# EAGLE design MTAP-Embedded (EAGLE 9.6.2)
ABTEILUNG: Technische Informatik; BEARBEITER: Simon Grundner; DATUM: 2022/10/05; DOKUMENTART: Schaltplan; GEZ: GruS; ID: 4AHEL; REV: 1; SCHALTPLAN: MTAP-MIDI-GC; STATUS: Prototyp; VER: 1.0

## Sheet 1 of 3
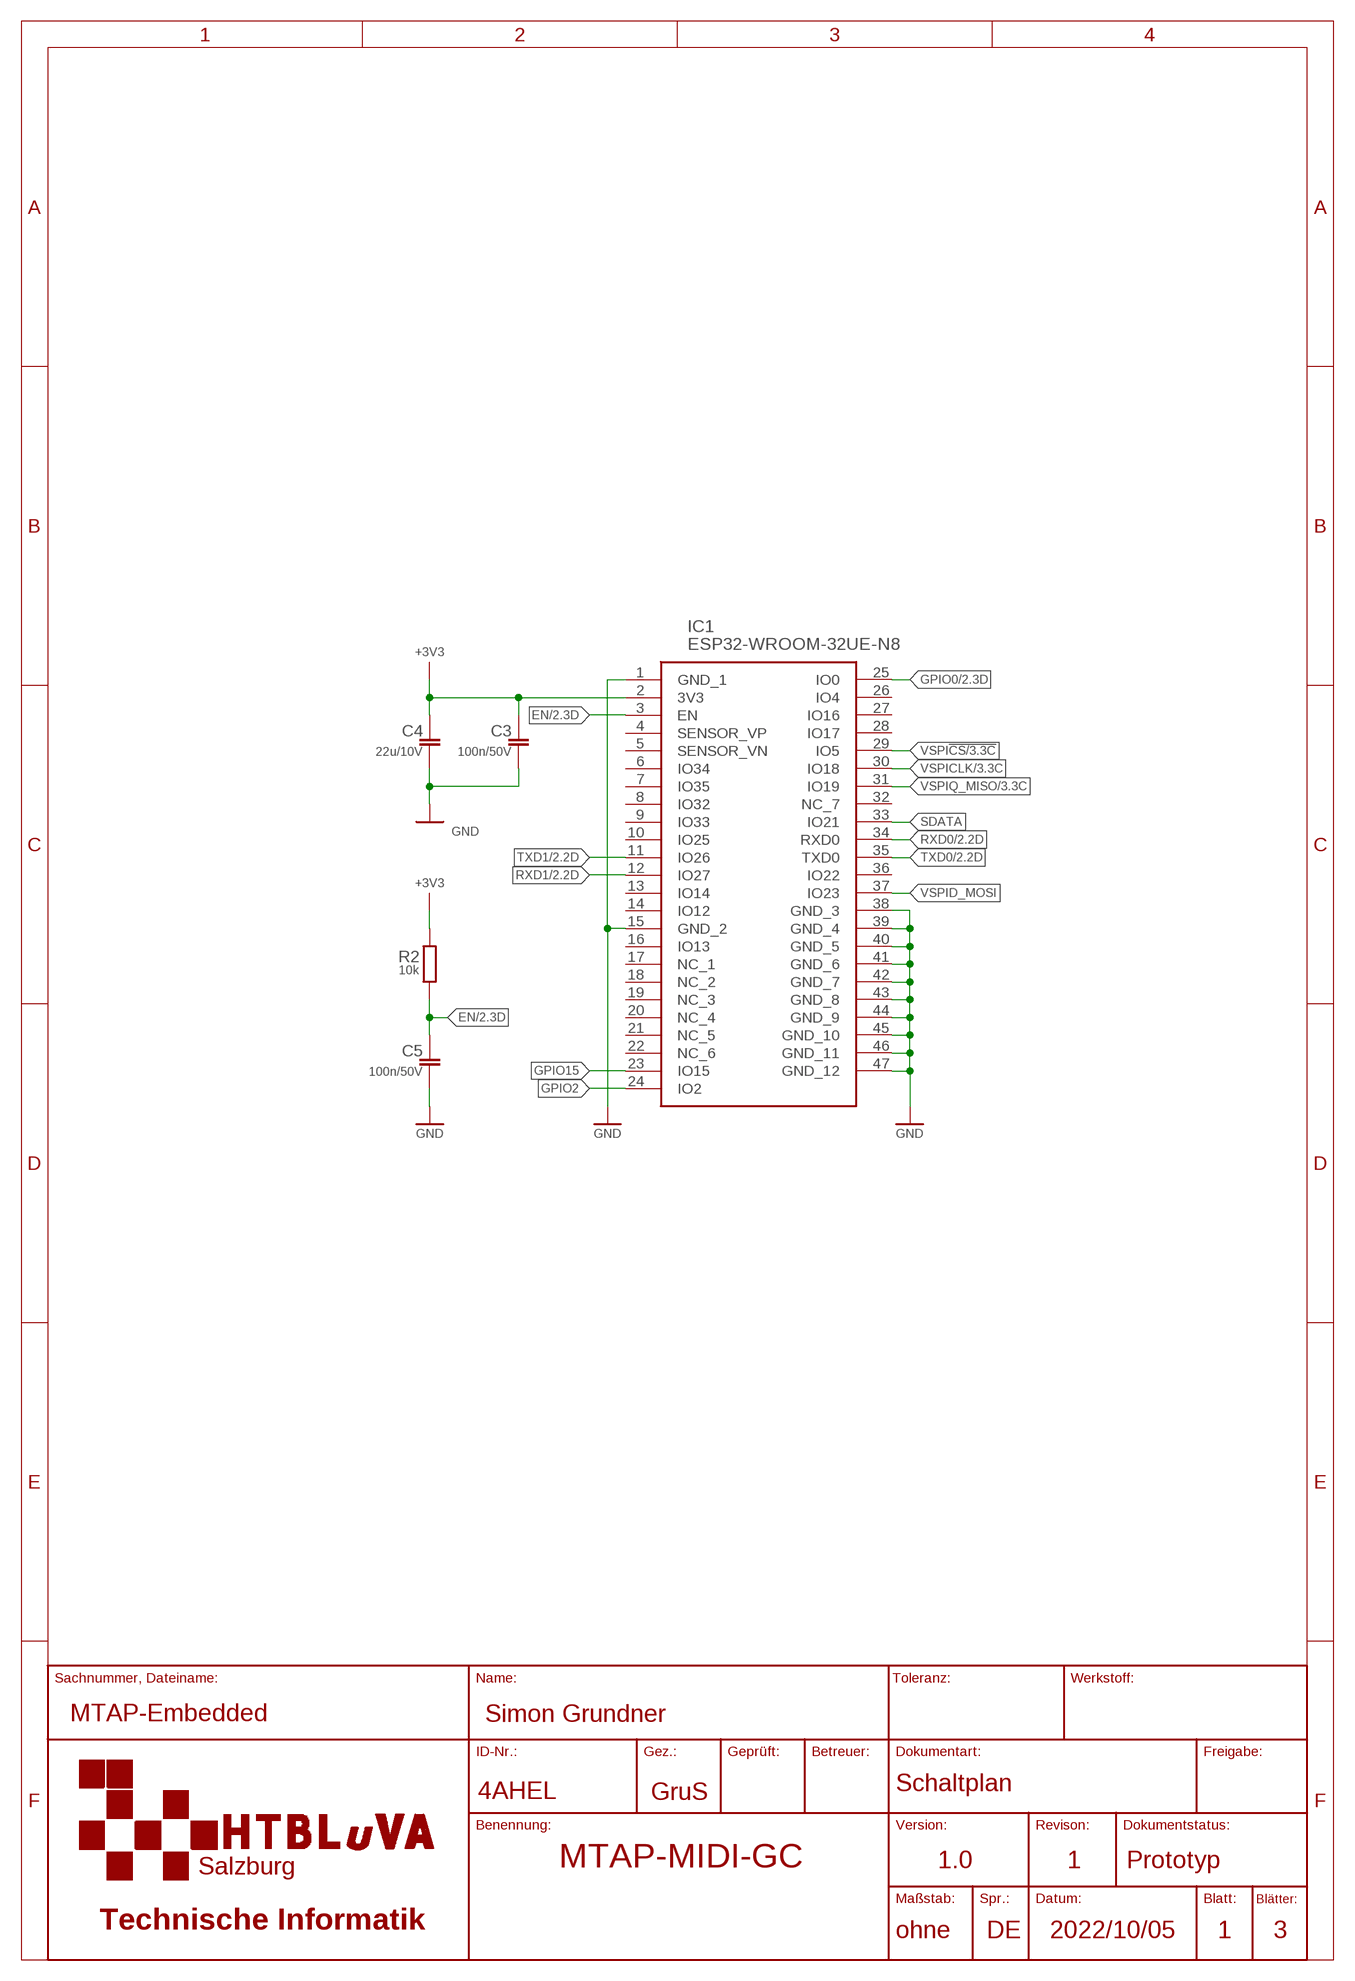
[diagram p0: schematic, sheet 1]

### Parts
C3  100n/50V  C-EUC0805  [C0805]
C4  22u/10V  C-EUC0805  [C0805]
C5  100n/50V  C-EUC0805  [C0805]
IC1  ESP32-WROOM-32UE-N8  [ESP32WROOM32UEN8]
R2  10k  R-EUSR0805  [R0805]

### Nets
+3V3: C3.1 C4.1 IC1.2(3V3) R2.2 ; also sheet 2,3
EN: C5.1 IC1.3(EN) R2.1 ; also sheet 2
GND: C3.2 C4.2 C5.2 IC1.1(GND_1) IC1.15(GND_2) IC1.38(GND_3) IC1.39(GND_4) IC1.40(GND_5) IC1.41(GND_6) IC1.42(GND_7) IC1.43(GND_8) IC1.44(GND_9) IC1.45(GND_10) IC1.46(GND_11) IC1.47(GND_12) ; also sheet 2
GPIO0: IC1.25(IO0) ; also sheet 2
GPIO2: IC1.24(IO2)
GPIO15: IC1.23(IO15)
RXD0: IC1.34(RXD0) ; also sheet 2
RXD1: IC1.12(IO27) ; also sheet 2
SDATA: IC1.33(IO21)
TXD0: IC1.35(TXD0) ; also sheet 2
TXD1: IC1.11(IO26) ; also sheet 2
VSPI!CS: IC1.29(IO5) ; also sheet 3
VSPICLK: IC1.30(IO18) ; also sheet 3
VSPID_MOSI: IC1.37(IO23)
VSPIQ_MISO: IC1.31(IO19) ; also sheet 3
Unconnected: IC1.4(SENSOR_VP) IC1.5(SENSOR_VN) IC1.6(IO34) IC1.7(IO35) IC1.8(IO32) IC1.9(IO33) IC1.10(IO25) IC1.13(IO14) IC1.14(IO12) IC1.16(IO13) IC1.17(NC_1) IC1.18(NC_2) IC1.19(NC_3) IC1.20(NC_4) IC1.21(NC_5) IC1.22(NC_6) IC1.26(IO4) IC1.27(IO16) IC1.28(IO17) IC1.32(NC_7) IC1.36(IO22)

## Sheet 2 of 3: Embedded
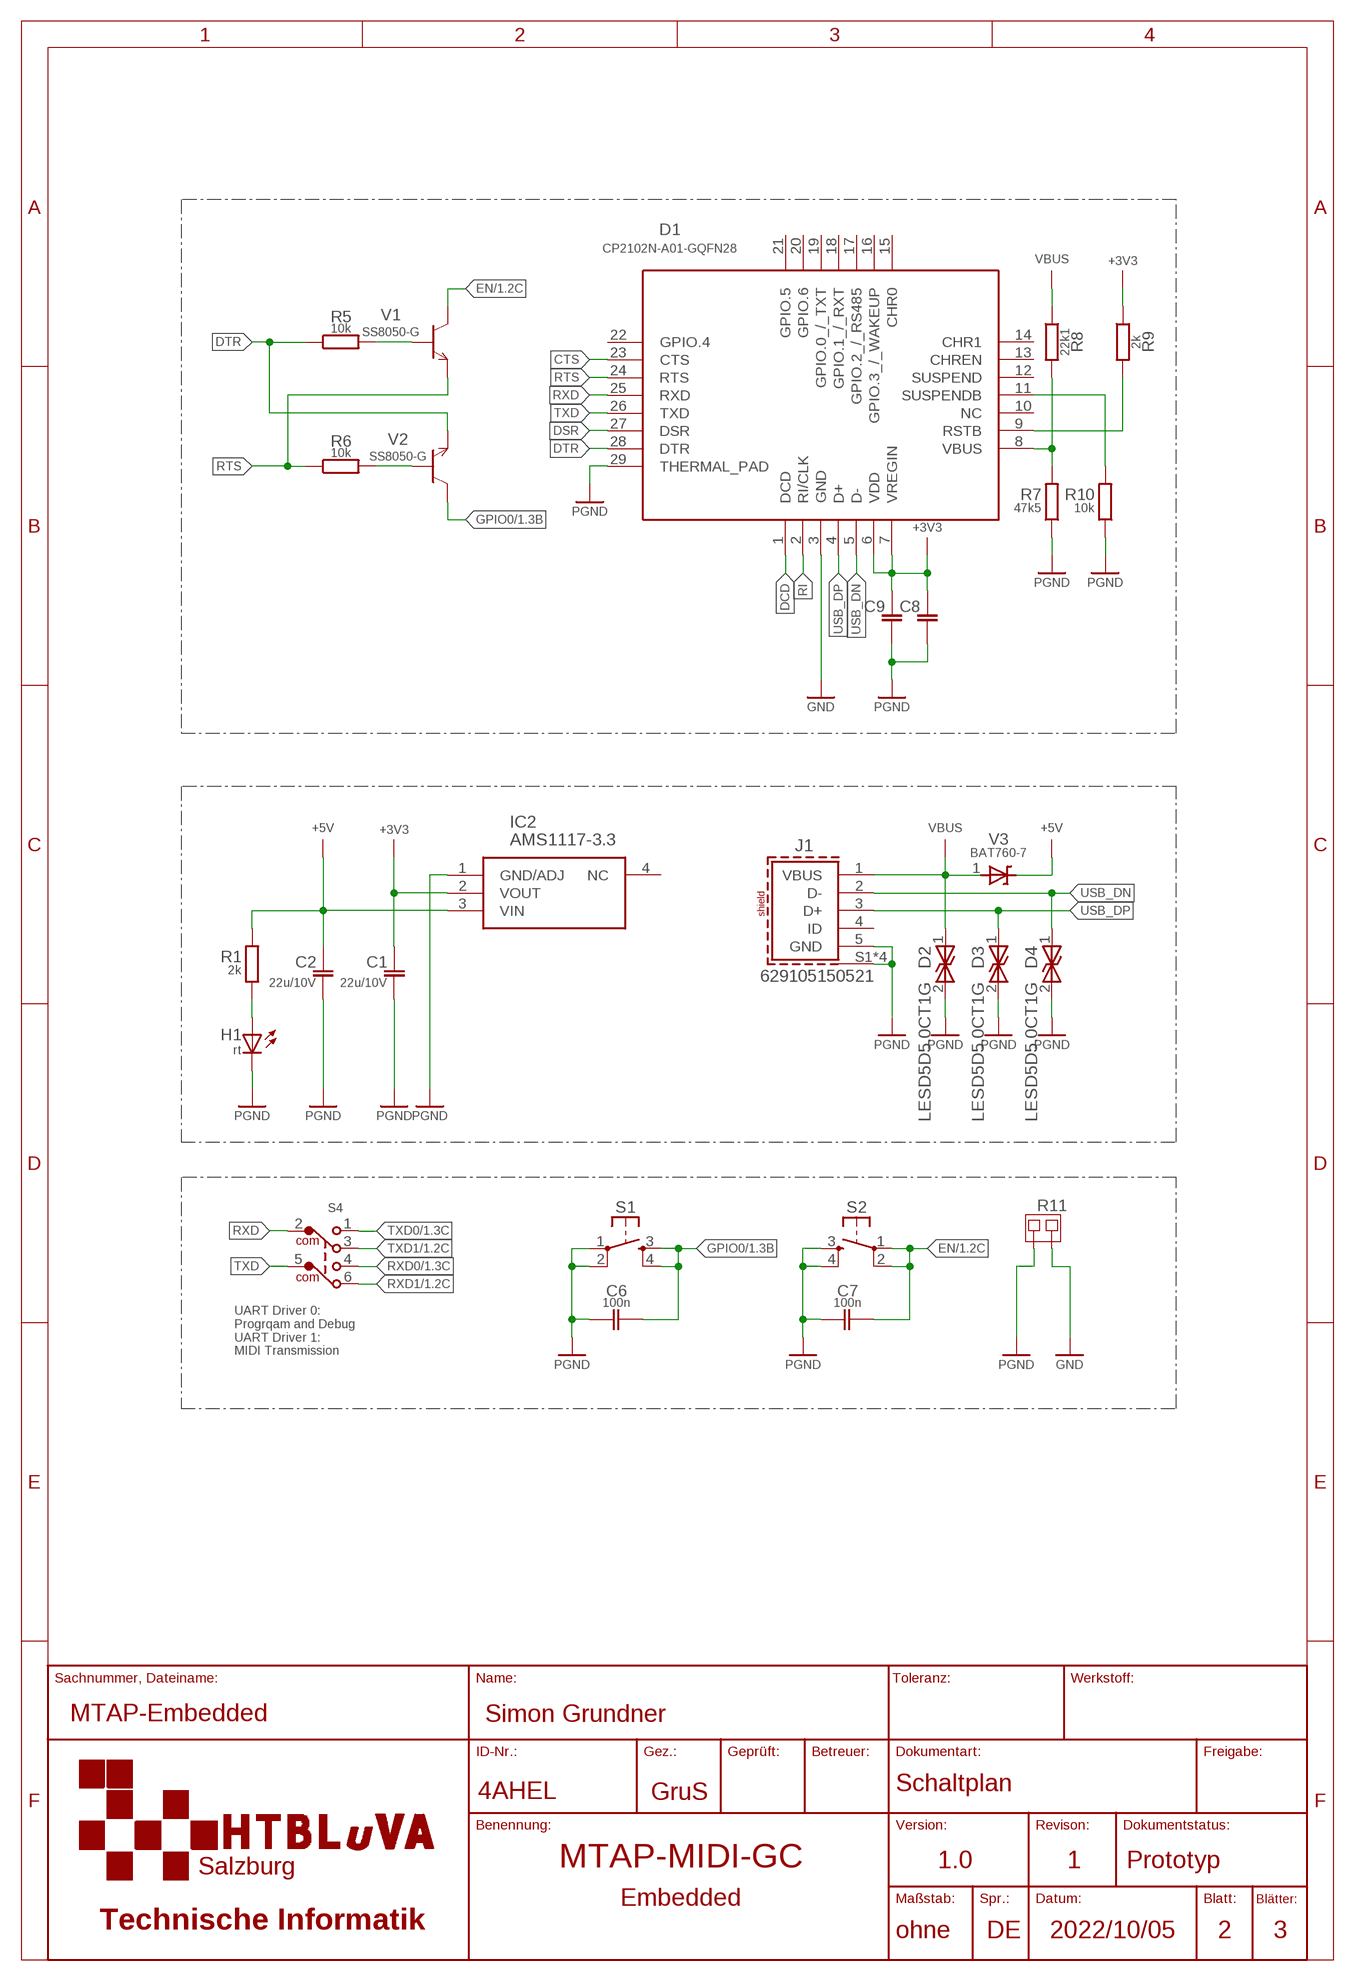
[diagram p1: schematic, sheet 2]

### Parts
C1  22u/10V  C-EUC0805  [C0805]
C2  22u/10V  C-EUC0805  [C0805]
C6  100n  C-EULC0805  [C0805]
C7  100n  C-EULC0805  [C0805]
C8  C-EUC0805  [C0805]
C9  C-EUC0805  [C0805]
D1  CP2102N-A01-GQFN28  [QFN28]
D2  LESD5D5.0CT1G  [SOD523]
D3  LESD5D5.0CT1G  [SOD523]
D4  LESD5D5.0CT1G  [SOD523]
H1  rt  LEDCHIP-LED0805  [CHIP-LED0805]
IC2  AMS1117-3.3  [SOT229P700X180-4N]
J1  629105150521  [629105150521]
R1  2k  R-EUSR0805  [R0805]
R5  10k  R-EU_R0805  [R0805]
R6  10k  R-EU_R0805  [R0805]
R7  47k5  R-EUSR0805  [R0805]
R8  22k1  R-EU_R0805  [R0805]
R9  2k  R-EU_R0805  [R0805]
R10  10k  R-EUSR0805  [R0805]
R11  0R  JUMPSMD1FACH-1SHORT  [MYLIB_SJ-SHORT]
S1  TASTE10XXWE  [WE_436331045822]
S2  TASTE10XXWE  [WE_436331045822]
S4  452404020202  [452404020202]
V1  SS8050-G  [SOT95P240X115-3N]
V2  SS8050-G  [SOT95P240X115-3N]
V3  BAT760-7  [SOD323]

### Nets
+3V3: C1.1 C8.1 C9.1 D1.6(VDD) D1.7(VREGIN) IC2.2(VOUT) R9.1 ; also sheet 1,3
+5V: C2.1 IC2.3(VIN) R1.2 V3.2(A)
CTS: D1.23(CTS)
DCD: D1.1(DCD)
DSR: D1.27(DSR)
DTR: D1.28(DTR) R5.1 V2.2(E)
EN: C7.1 S2.1(P) S2.2(P1) V1.3(C) ; also sheet 1
GND: D1.3(GND) R11.2 ; also sheet 1
GPIO0: C6.1 S1.3(S) S1.4(S1) V2.3(C) ; also sheet 1
N$1: H1.A R1.1
N$2: D1.8(VBUS) R7.2 R8.2
N$3: D1.11(SUSPENDB) R10.2
N$4: D1.9(RSTB) R9.2
N$15: R5.2 V1.1(B)
N$16: R6.2 V2.1(B)
PGND: C1.2 C2.2 C6.2 C7.2 C8.2 C9.2 D1.29(THERMAL_PAD) D2.2 D3.2 D4.2 H1.C IC2.1(GND/ADJ) J1.5(GND) J1.S1(SHIELD) J1.S2(SHIELD) J1.S3(SHIELD) J1.S4(SHIELD) R7.1 R10.1 R11.1 S1.1(P) S1.2(P1) S2.3(S) S2.4(S1)
RI: D1.2(RI/CLK)
RTS: D1.24(RTS) R6.1 V1.2(E)
RXD: D1.25(RXD) S4.2(COM)
RXD0: S4.4 ; also sheet 1
RXD1: S4.6 ; also sheet 1
TXD: D1.26(TXD) S4.5(COM1)
TXD0: S4.1 ; also sheet 1
TXD1: S4.3 ; also sheet 1
USB_DN: D1.5(D-) D4.1 J1.2(D-)
USB_DP: D1.4(D+) D3.1 J1.3(D+)
VBUS: D2.1 J1.1(VBUS) R8.1 V3.1(K)
Unconnected: D1.10(NC) D1.12(SUSPEND) D1.13(CHREN) D1.14(CHR1) D1.15(CHR0) D1.16(GPIO.3_/_WAKEUP) D1.17(GPIO.2_/_RS485) D1.18(GPIO.1_/_RXT) D1.19(GPIO.0_/_TXT) D1.20(GPIO.6) D1.21(GPIO.5) D1.22(GPIO.4) IC2.4(NC) J1.4(ID)

### Notes on the sheet
- UART Driver 0:
  Progrqam and Debug
  UART Driver 1:
  MIDI Transmission

## Sheet 3 of 3: Analog
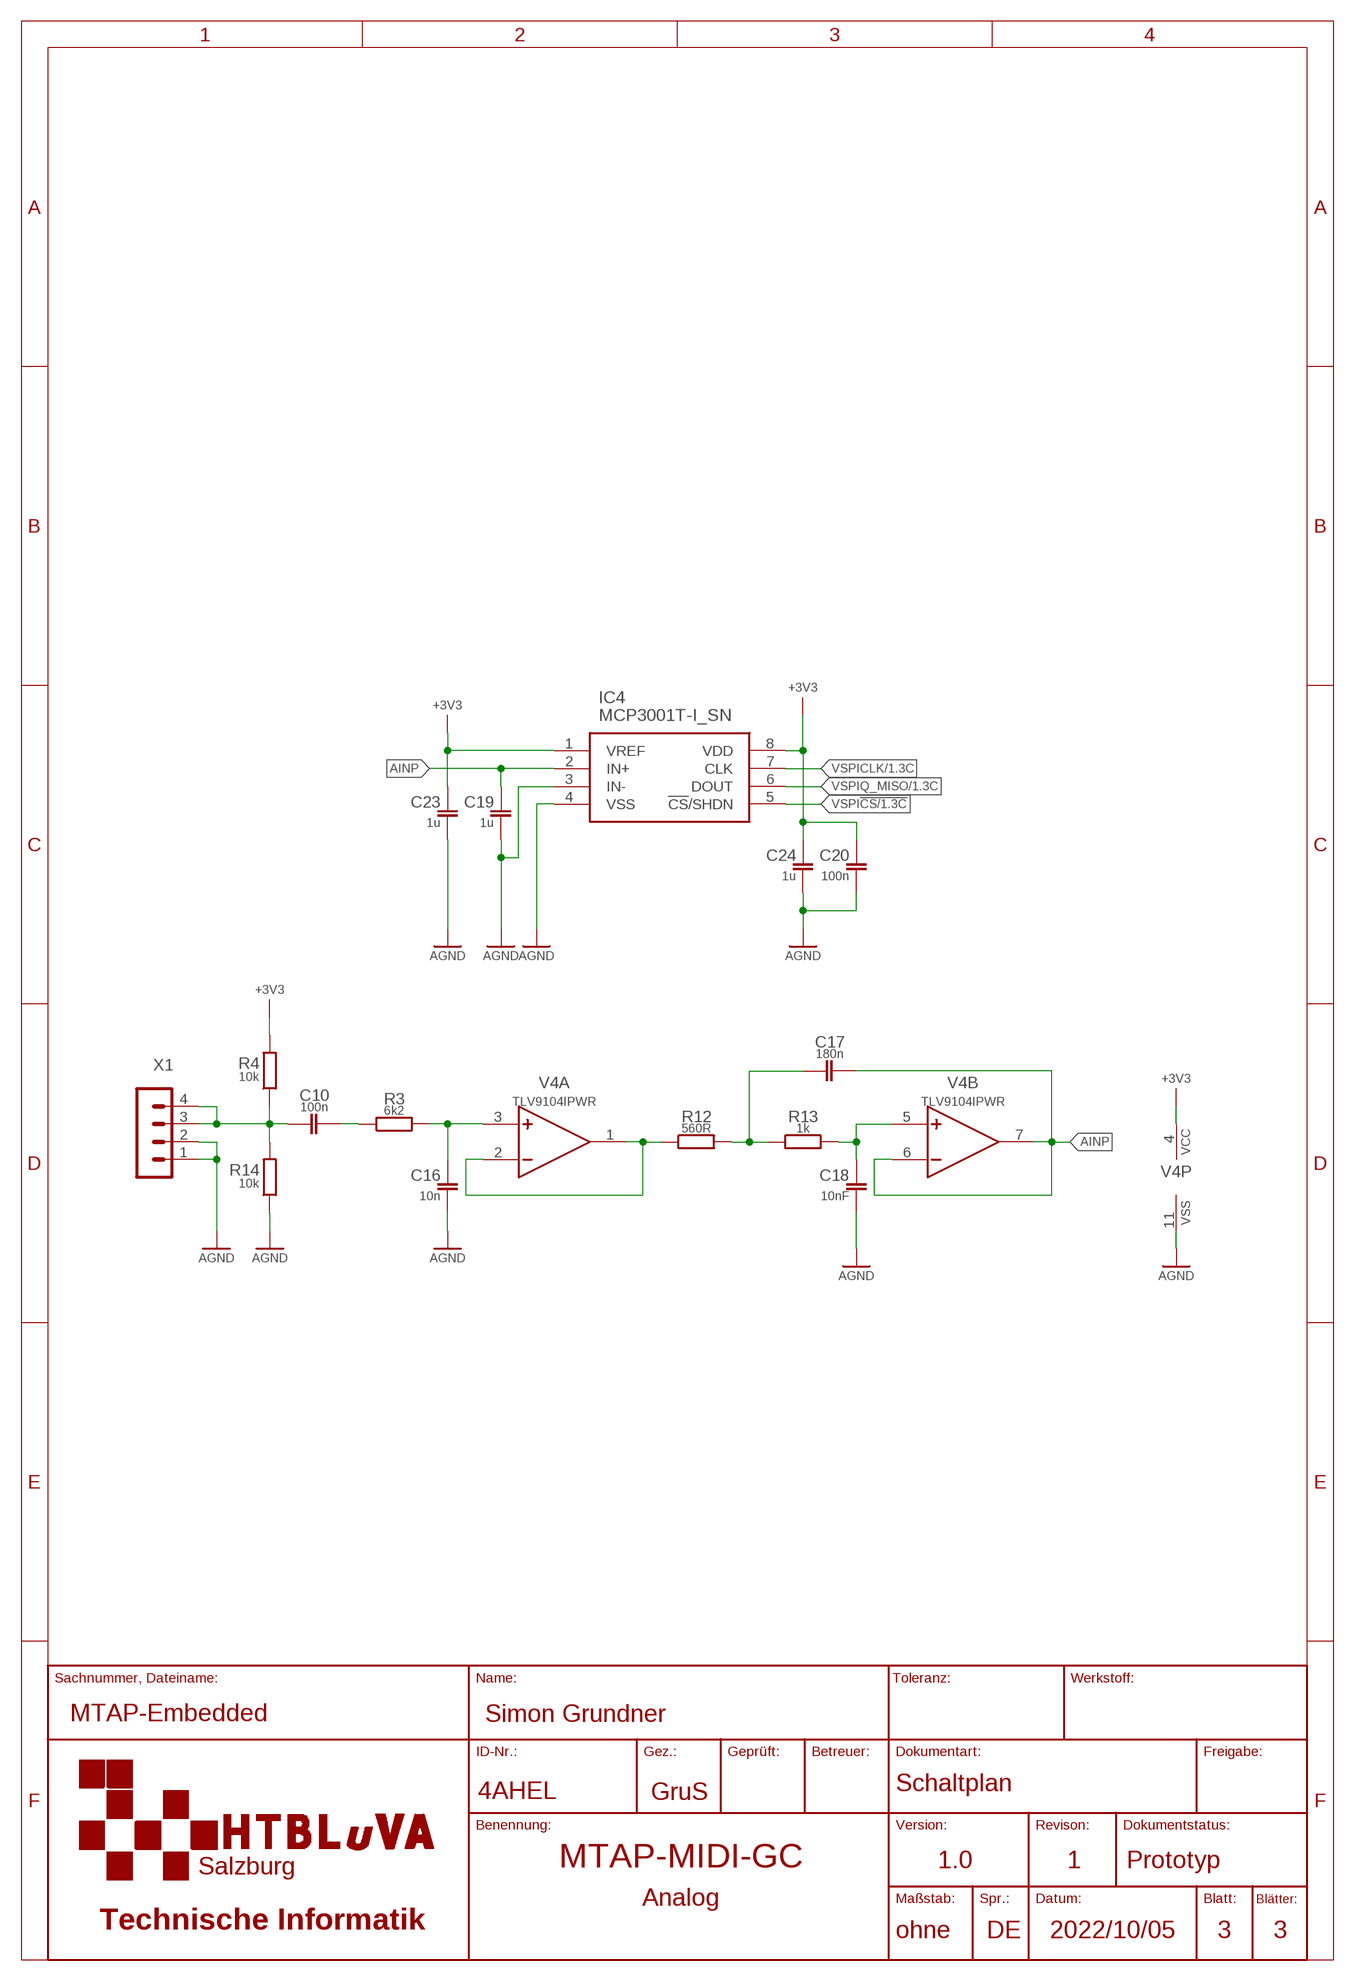
[diagram p2: schematic, sheet 3]

### Parts
C10  100n  C-EULC0805  [C0805]
C16  10n  C-EUC0805  [C0805]
C17  180n  C-EULC0805  [C0805]
C18  10nF  C-EUC0805  [C0805]
C19  1u  C-EUC0805  [C0805]
C20  100n  C-EUC0805  [C0805]
C23  1u  C-EUC0805  [C0805]
C24  1u  C-EUC0805  [C0805]
IC4  MCP3001T-I_SN  [SOIC127P600X175-8N]
R3  6k2  R-EU_R0805  [R0805]
R4  10k  R-EUSR0805  [R0805]
R12  560R  R-EU_R0805  [R0805]
R13  1k  R-EU_R0805  [R0805]
R14  10k  R-EUSR0805  [R0805]
V4  TLV9104IPWR  [SOP65P640X120-14N]
X1  MA04-1  [MA04-1]

### Nets
+3V3: C20.1 C23.1 C24.1 IC4.1(VREF) IC4.8(VDD) R4.2 V4.4(P:VCC) ; also sheet 1,2
AGND: C16.2 C18.2 C19.2 C20.2 C23.2 C24.2 IC4.3(IN-) IC4.4(VSS) R14.1 V4.11(P:VSS) X1.1 X1.2
AINP: C17.1 C19.1 IC4.2(IN+) V4.6(B:N) V4.7(B:O)
N$6: R12.1 V4.1(A:O) V4.2(A:N)
N$7: C16.1 R3.2 V4.3(A:P)
N$8: C10.1 R3.1
N$9: C17.2 R12.2 R13.1
N$12: C18.1 R13.2 V4.5(B:P)
N$17: C10.2 R4.1 R14.2 X1.3 X1.4
VSPI!CS: IC4.5(!CS!/SHDN) ; also sheet 1
VSPICLK: IC4.7(CLK) ; also sheet 1
VSPIQ_MISO: IC4.6(DOUT) ; also sheet 1
Unconnected: V4.8(C:O) V4.9(C:N) V4.10(C:P) V4.12(D:P) V4.13(D:N) V4.14(D:O)

## Library data of the parts
C1-C5 C8 C9 C16 C18-C20 C23 C24 = rcl_GruS:C-EU: CAPACITOR, European symbol
C6 C7 C10 C17 = rcl_GruS:C-EUL: CAPACITOR, European symbol
D1 = ic_GruS:CP2102N-A01-GQFN28: SILICON LABS - CP2102N-A01-GQFN28 - USB-UART INTERFACE BRIDGE, QFN-28 Source: Datasheet <http://www.farnell.com/datasheets/2245279.pdf>; ARROW_PART_NUMBER: CP2102N-A01-GQFN28; ARROW_PRICE-STOCK: https://www.arrow.com/en/products/cp2102n-a01-gqfn28/silicon-labs; DESCRIPTION: SILICON LABS - CP2102N-A01-GQFN28 - USB-UART INTERFACE BRIDGE, QFN-28; HEIGHT: 0.8mm; MANUFACTURER_NAME: Silicon Labs; MANUFACTURER_PART_NUMBER: CP2102N-A01-GQFN28; MOUSER_PART_NUMBER: 634-CP2102NA01GQFN28; MOUSER_PRICE-STOCK: https://www.mouser.co.uk/ProductDetail/Silicon-Labs/CP2102N-A01-GQFN28?qs=%252BaFUgn%2FzHmxGRIXZFn%252Btdg%3D%3D
D2-D4 = diode_GruS:LESD5D5.0CT1G: Diodes - ESD SOD-523 RoHS Source: Datasheet <https://datasheet.lcsc.com/szlcsc/1908071806_Leshan-Radio-LESD5D5-0CT1G_C383211.pdf>; DESCRIPTION: Diodes - ESD SOD-523 RoHS; HEIGHT: 0.7mm; MANUFACTURER_NAME: Leshan Radio; MANUFACTURER_PART_NUMBER: LESD5D5.0CT1G
H1 = led_GruS:LED: LED, EN-60617 OSRAM: - CHIPLED LG R971, LG N971, LY N971, LG Q971, LY Q971, LO R971, LY R971 LH N974, LH R974 LS Q976, LO Q976, LY Q976 LO Q996 - Hyper CHIPLED LW Q18S LB Q993, LB Q99A, LB R99A - SideLED LS A670, LO A670, LY A670, LG A670, LP A670 LB A673, LV A673, LT A673, LW A673 LH A674 LY A675 LS A676, LA A676, LO A676, LY A676, LW A676 LS A679, LY A679, LG A679 - Hyper Micro SIDELED® LS Y876, LA Y876, LO Y876, LY Y876 LT Y87S - SmartLED LW L88C, LW L88S LB L89C, LB L89S, LG L890 LS L89K, LO L89K, LY L89K LS L896, LA L896, LO L896, LY L896 - TOPLED LS T670, LO T670, LY T670, LG T670, LP T670 LSG T670, LSP T670, LSY T670, LOP T670, LYG T670 LG T671, LOG T671, LSG T671 LB T673, LV T673, LT T673, LW T673 LH T674 LS T676, LA T676, LO T676, LY T676, LB T676, LH T676, LSB T676, LW T676 LB T67C, LV T67C, LT T67C, LS T67K, LO T67K, LY T67K, LW E67C LS E67B, LA E67B, LO E67B, LY E67B, LB E67C, LV E67C, LT E67C LW T67C LS T679, LY T679, LG T679 LS T770, LO T770, LY T770, LG T770, LP T770 LB T773, LV T773, LT T773, LW T773 LH T774 LS E675, LA E675, LY E675, LS T675 LS T776, LA T776, LO T776, LY T776, LB T776 LHGB T686 LT T68C, LB T68C - Hyper Mini TOPLED® LB M676 - Mini TOPLED Santana® LG M470 LS M47K, LO M47K, LY M47K Source: http://www.osram.convergy.de LUXEON: - LUMILED® LXK2-PW12-R00, LXK2-PW12-S00, LXK2-PW14-U00, LXK2-PW14-V00 LXK2-PM12-R00, LXK2-PM12-S00, LXK2-PM14-U00 LXK2-PE12-Q00, LXK2-PE12-R00, LXK2-PE12-S00, LXK2-PE14-T00, LXK2-PE14-U00 LXK2-PB12-K00, LXK2-PB12-L00, LXK2-PB12-M00, LXK2-PB14-N00, LXK2-PB14-P00, LXK2-PB14-Q00 LXK2-PR12-L00, LXK2-PR12-M00, LXK2-PR14-Q00, LXK2-PR14-R00 LXK2-PD12-Q00, LXK2-PD12-R00, LXK2-PD12-S00 LXK2-PH12-R00, LXK2-PH12-S00 LXK2-PL12-P00, LXK2-PL12-Q00, LXK2-PL12-R00 Source: www.luxeon.com KINGBRIGHT: KA-3528ASYC Source: www.kingbright.com
IC1 = modul_GruS:ESP32-WROOM-32UE-N8: Multiprotocol Modules SMD module ESP32-WROOM-32UE, ESP32-D0WD-V3, ESP32 ECO V3, 8 MB SPI flash, IPEX antenna connector Source: Datasheet <https://www.espressif.com/sites/default/files/documentation/esp32-wroom-32e_esp32-wroom-32ue_datasheet_en.pdf>; DESCRIPTION: Multiprotocol Modules SMD module ESP32-WROOM-32UE, ESP32-D0WD-V3, ESP32 ECO V3, 8 MB SPI flash, IPEX antenna connector; HEIGHT: 3.35mm; MANUFACTURER_NAME: Espressif Systems; MANUFACTURER_PART_NUMBER: ESP32-WROOM-32UE-N8; MOUSER_PART_NUMBER: 356-ESP32WRM32UE64UH; MOUSER_PRICE-STOCK: https://www.mouser.co.uk/ProductDetail/Espressif-Systems/ESP32-WROOM-32UE-N8?qs=Li%252BoUPsLEntX6CSaKZB9vw%3D%3D
IC2 = vreg_GruS:AMS1117-3.3: Descriptions of ams AMS1117-3.3 provided by its distributors. Source: Datasheet <https://datasheet.datasheetarchive.com/originals/distributors/Datasheets-28/DSA-550594.pdf>; DESCRIPTION: Descriptions of ams AMS1117-3.3 provided by its distributors.; HEIGHT: 1.8mm; MANUFACTURER_NAME: Advanced; MANUFACTURER_PART_NUMBER: AMS1117-3.3
IC4 = adc-dac_GruS:MCP3001T-I_SN: Analog to Digital Converters - ADC 10-bit SPI Sgl Chl IND TEMP, SOIC8 Source: Datasheet <http://www.microchip.com/mymicrochip/filehandler.aspx?ddocname=en011533>; ARROW_PART_NUMBER: MCP3001T-I/SN; ARROW_PRICE-STOCK: https://www.arrow.com/en/products/mcp3001t-isn/microchip-technology?region=nac; DESCRIPTION: Analog to Digital Converters - ADC 10-bit SPI Sgl Chl IND TEMP, SOIC8; HEIGHT: 1.75mm; MANUFACTURER_NAME: Microchip; MANUFACTURER_PART_NUMBER: MCP3001T-I/SN; MOUSER_PART_NUMBER: 579-MCP3001T-I/SN; MOUSER_PRICE-STOCK: https://www.mouser.co.uk/ProductDetail/Microchip-Technology-Atmel/MCP3001T-I-SN?qs=rh436G1KrYxYH73wf1FE%252Bw%3D%3D
J1 = Wurth_Connectors_WR-USB:629105150521: Type B with Pegs, High Current at Pin 1 & Pin 5 Micro USB 2.0 SMT Type B Horizontal 5 Contacts High Current Kind Properties Durability:10 000 Mating cycles Quality Class:10 000 Mating cycles Connector Type:Micro USB Gender:Receptacle Type:Horizontal General Information Operating Temperature:-40up to +105 °C Compliance:RoHS Electrical Properties IR 1:3A Working Voltage:30V (AC) Withstanding Voltage:100V (AC) Contact Resistance:30 mΩ Material Properties Insulator Material:LCP Insulator Flammability Rating:UL94 V-0 Color:Black Contact Material:Copper Alloy Contact Plating: Gold Contact Type:Stamped Shielding Material:Stainless Steel Shielding Plating:Nickel <https://www.we-online.com/catalog/media/o86333v209%20WR-COM_629105150521_family.jpg> Details see: https://www.we-online.com/catalog/en/COM_MICRO_SMT_TYPE_B_HORIZONTAL_HIGH_CURRENT/ Updated by Ella Wu 2021-09-28 2021 (C) Würth Elektronik; APPLICATION: Micro USB 2.0; DATASHEET-URL: https://www.we-online.com/redexpert/spec/629105150521?ae; GERDER: Receptacle; INTERFACE-TYPE: Type B; IR: 3.0A; MOUNT: SMT; PACKAGING: Tape and Reel; PART-NUMBER: 629105150521; PINS: 5; TYPE: Horizontal; WORKING-VOLTAGE: 30V(AC)
R1 R2 R4 R7 R10 R14 = rcl_GruS:R-EUS: RESISTOR, European symbol
R3 R5 R6 R8 R9 R12 R13 = rcl_GruS:R-EU_: RESISTOR, European symbol
R11 = con_GruS:JUMPSMD1FACH-1: SMD solder JUMPER
S1 S2 = switch_GruS:TASTE10XX: OMRON SWITCH
S4 = switch_GruS:452404020202: WS-SLTV THT Mini Slide Switch, Same Side Connection 9.0x3.5 mm Properties Actuator Material:PA9T Actuator Flammability Rating:UL94 HB Actuator Color:Black Frame Material:LCP Frame Flammability Rating:UL94 V-0 Frame Color:Black Contact Material:Copper Alloy Contact Plating:Silver Terminal Material:Copper Alloy Terminal Plating:Silver Schematic:DPDT Switching Function:On-On Connection Type:Same Side Connection Operating Temperature:-40 up to +85 °C Qty.:200 Material Properties Cover Material :Stainless Steel Mechanical Properties Electrical Life:2000 Steps Switching Function:On-On Connection Type:Same Side Connection Packaging Properties Packaging :Bulk <https://www.we-online.com/catalog/media/o107346v209%20Family_WS-SLTV_452404020202.jpg> Details see: https://www.we-online.com/catalog/en/SLTV_9X3_5_THT/ Updated by yingchun,Shan;2020-02-24 2020(C) Würth Elektronik; DATASHEET-URL: https://www.we-online.com/catalog/datasheet/452404020202.pdf; PACKAGING: Bulk; PART-NUMBER: 452404020202; QTY: 200
V1 V2 = transistor_GruS:SS8050-G: Bipolar Transistors - BJT NPN TRANSISTOR 1.5A 40V Source: Datasheet <https://datasheet.datasheetarchive.com/originals/distributors/DKDS-12/229454.pdf>; ARROW_PART_NUMBER: SS8050-G; ARROW_PRICE-STOCK: https://www.arrow.com/en/products/ss8050-g/comchip-technology?region=nac; DESCRIPTION: Bipolar Transistors - BJT NPN TRANSISTOR 1.5A 40V; HEIGHT: 1.15mm; MANUFACTURER_NAME: Comchip Technology; MANUFACTURER_PART_NUMBER: SS8050-G; MOUSER_PART_NUMBER: 750-SS8050-G; MOUSER_PRICE-STOCK: https://www.mouser.co.uk/ProductDetail/Comchip-Technology/SS8050-G?qs=LLUE9lz1YbcHg%252BWLMAtcrQ%3D%3D
V3 = diode_GruS:BAT760-7: Diode Schottky 30V 1A 2Pin SOD323 Diodes Inc BAT760-7, SMT Schottky Diode, 30V 1A, 2-Pin SOD-323 Source: Datasheet <https://www.diodes.com/assets/Datasheets/ds30498.pdf>; ARROW_PART_NUMBER: BAT760-7; ARROW_PRICE-STOCK: https://www.arrow.com/en/products/bat760-7/diodes-incorporated?region=asia; DESCRIPTION: Diode Schottky 30V 1A 2Pin SOD323 Diodes Inc BAT760-7, SMT Schottky Diode, 30V 1A, 2-Pin SOD-323; HEIGHT: 1.2mm; MANUFACTURER_NAME: Diodes Inc.; MANUFACTURER_PART_NUMBER: BAT760-7; MOUSER_PART_NUMBER: 621-BAT760-7; MOUSER_PRICE-STOCK: https://www.mouser.co.uk/ProductDetail/Diodes-Incorporated/BAT760-7?qs=JV7lzlMm3yKDDyO09xoRbQ%3D%3D
V4 = opv_GruS:TLV9104*: Operational Amplifiers - Op Amps Quad 1MHz, 16-V rail-to-rail input/output, low-offset voltage, low-power op amp Source: Datasheet <https://www.ti.com/lit/ds/symlink/tlv9104.pdf?ts=1602535718117&ref_url=https%3A%2F%2Fwww.ti.com%2Fproduct%2FTLV9104%3FkeyMatch%3DTLV9104IPWR%26tisearch%3DSearch-EN-everything%26usecase%3DOPN>; ARROW_PART_NUMBER: TLV9104IPWR; ARROW_PRICE-STOCK: https://www.arrow.com/en/products/tlv9104ipwr/texas-instruments?region=nac; DESCRIPTION: Operational Amplifiers - Op Amps Quad 1MHz, 16-V rail-to-rail input/output, low-offset voltage, low-power op amp; HEIGHT: 1.2mm; MANUFACTURER_NAME: Texas Instruments; MANUFACTURER_PART_NUMBER: TLV9104IPWR; MOUSER_PART_NUMBER: 595-TLV9104IPWR; MOUSER_PRICE-STOCK: https://www.mouser.co.uk/ProductDetail/Texas-Instruments/TLV9104IPWR?qs=zW32dvEIR3tiifKVqwaCiA%3D%3D
X1 = con-lstb:MA04-1: PIN HEADER; OC_FARNELL: unknown; OC_NEWARK: unknown

## Net classes
0 default: width 0.152 mm, clearance 0.205 mm
1 +3V3: width 0.813 mm
2 VBUS: width 0.813 mm
3 +5V: width 0.813 mm

## Board
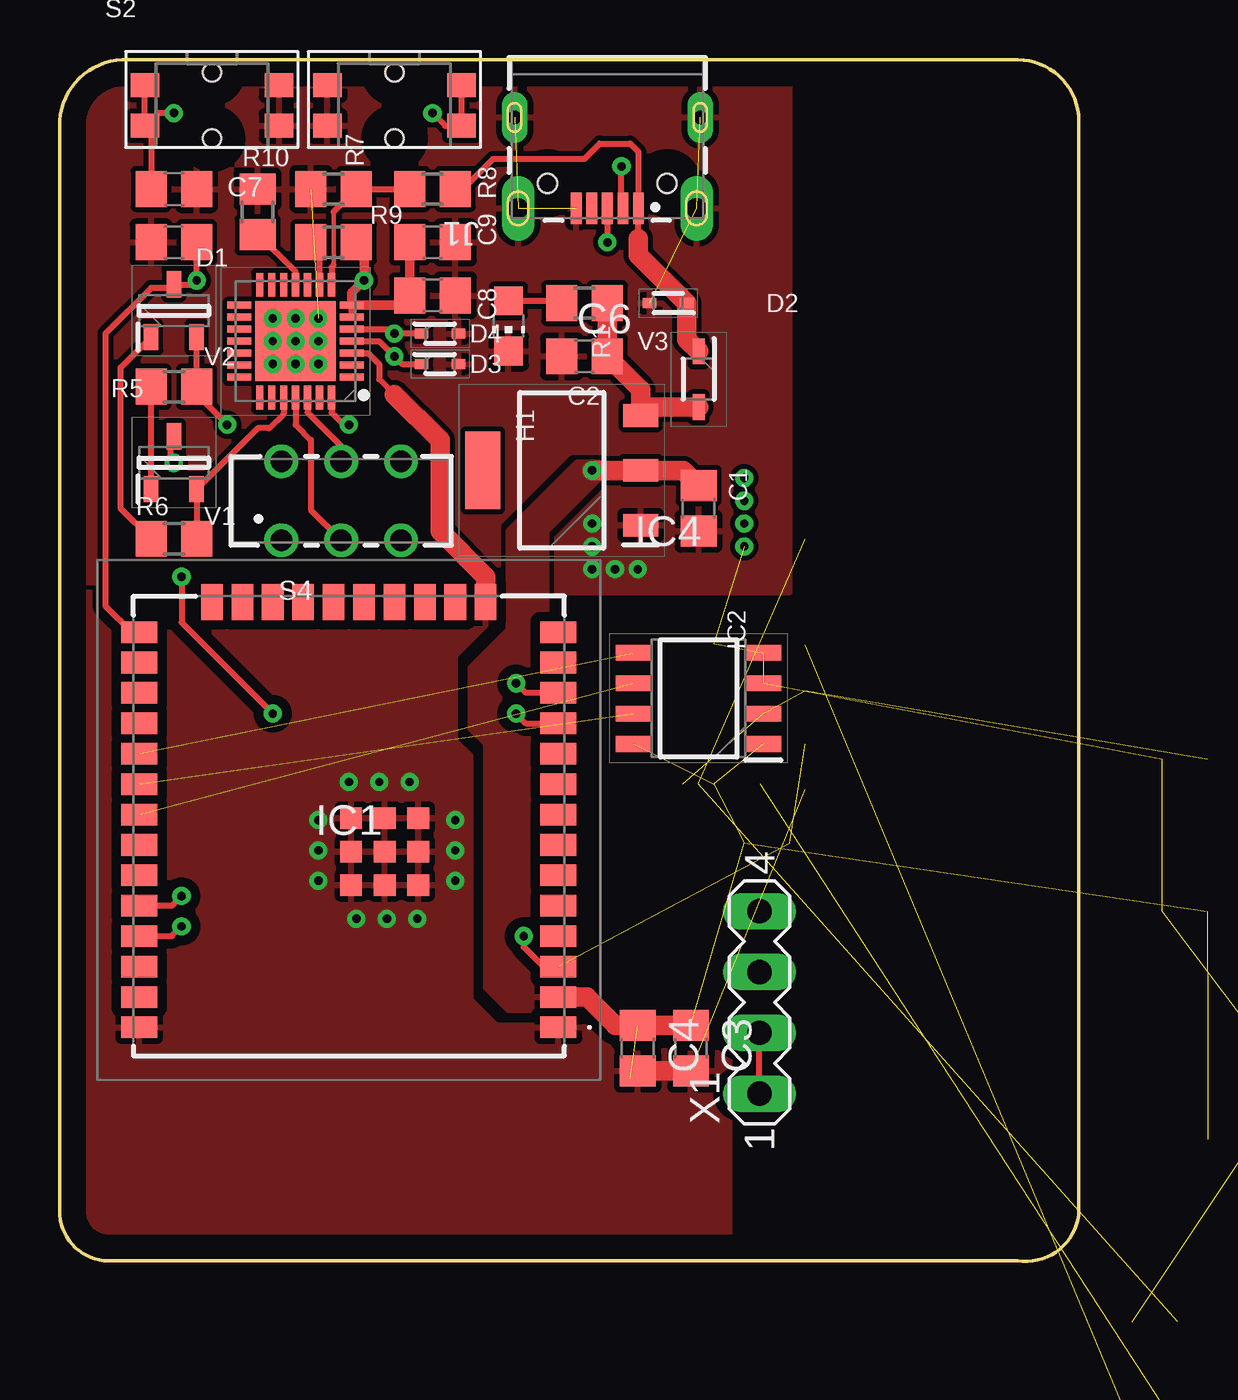
[diagram p3: board, top side]
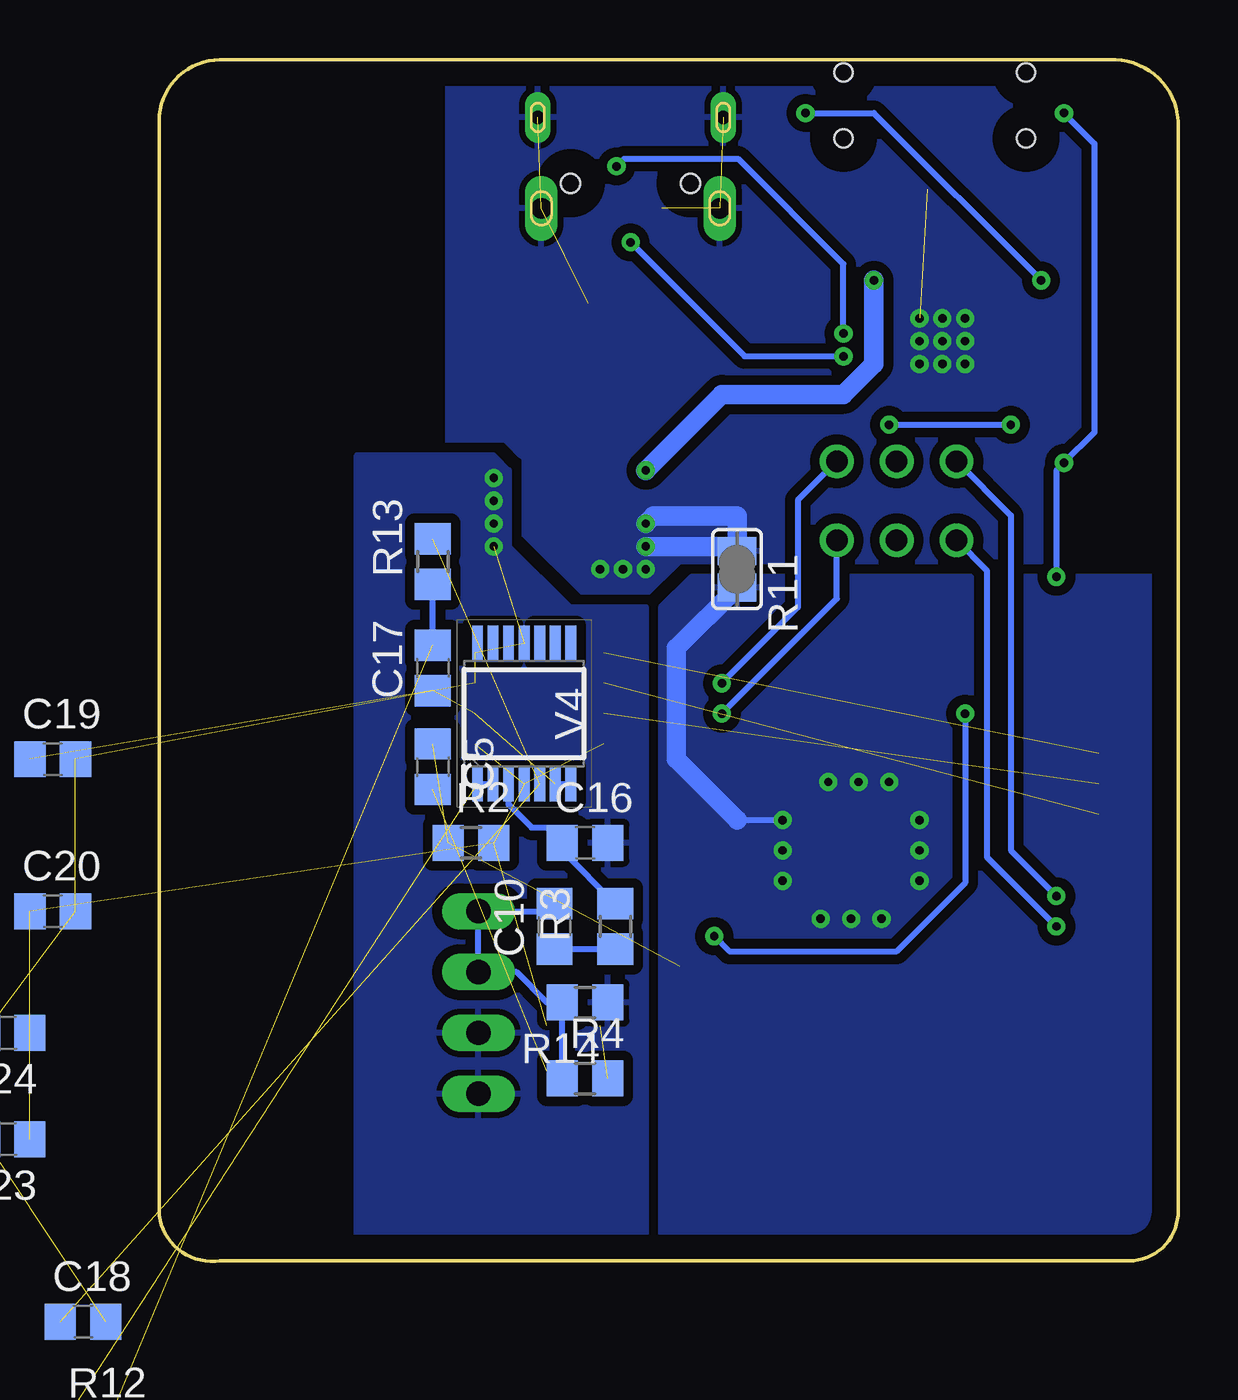
[diagram p4: board, bottom side, seen from below]

Size 42.55 x 50.19 mm. Coordinates in mm from the lower left corner, seen from the top.
Outline: 2.86,50.19 40,50.19 arc-90 42.55,47.65 42.55,1.93 arc-90 40,0.02 2.22,0.02 arc-90 0,1.93 0,47.65 arc-90 2.86,50.19
Copper layers (1*16): Top 0.035mm / dielectric 1.5mm / Bottom 0.035mm
Design rules "default *": minimum track width 5mil, minimum drill 0.2mm, track to track 6mil, track to pad 6mil, pad to pad 6mil, via to via 6mil, smd to smd 6mil, copper to edge 40mil, drill to drill 6mil, minimum pad ring 10mil, minimum via ring 8mil, stop-mask expansion 4mil, vias tented up to drill 0mil, thermal gap 10mil

### Footprints (pad centres in the part's own frame; a part is rotated, then mirrored left to right if it is on the bottom)
C0805 = smd 1.3 x 1.5: 1 -0.95,0; 2 0.95,0
QFN28 = smd 1 x 0.3: 1 -2.35,1.5; 2 -2.35,1; 3 -2.35,0.5; 4 -2.35,0; 5 -2.35,-0.5; 6 -2.35,-1; 7 -2.35,-1.5; 15 2.35,-1.5; 16 2.35,-1; 17 2.35,-0.5; 18 2.35,0; 19 2.35,0.5; 20 2.35,1; 21 2.35,1.5 | smd 0.3 x 1: 8 -1.5,-2.35; 9 -1,-2.35; 10 -0.5,-2.35; 11 0,-2.35; 12 0.5,-2.35; 13 1,-2.35; 14 1.5,-2.35; 22 1.5,2.35; 23 1,2.35; 24 0.5,2.35; 25 0,2.35; 26 -0.5,2.35; 27 -1,2.35; 28 -1.5,2.35 | smd 3.35 x 3.35: 29 0,0
SOD523 = smd 0.57 x 0.42: 1 -0.775,0; 2 0.775,0
CHIP-LED0805 = smd 1.2 x 1.2: A 0,-1.05; C 0,1.05
ESP32WROOM32UEN8 = smd 1.5 x 0.9: 1 -8.75,8.66; 2 -8.75,7.39; 3 -8.75,6.12; 4 -8.75,4.85; 5 -8.75,3.58; 6 -8.75,2.31; 7 -8.75,1.04; 8 -8.75,-0.23; 9 -8.75,-1.5; 10 -8.75,-2.77; 11 -8.75,-4.04; 12 -8.75,-5.31; 13 -8.75,-6.58; 14 -8.75,-7.85; 25 8.75,-7.85; 26 8.75,-6.58; 27 8.75,-5.31; 28 8.75,-4.04; 29 8.75,-2.77; 30 8.75,-1.5; 31 8.75,-0.23; 32 8.75,1.04; 33 8.75,2.31; 34 8.75,3.58; 35 8.75,4.85; 36 8.75,6.12; 37 8.75,7.39; 38 8.75,8.66 | smd 0.9 x 1.5: 15 -5.715,-9.1; 16 -4.445,-9.1; 17 -3.175,-9.1; 18 -1.905,-9.1; 19 -0.635,-9.1; 20 0.635,-9.1; 21 1.905,-9.1; 22 3.175,-9.1; 23 4.445,-9.1; 24 5.715,-9.1 | smd 0.9 x 0.9: 39 -1.5,1.32; 40 -2.9,1.32; 41 -2.9,-0.08; 42 -1.5,-0.08; 43 -0.1,-0.08; 44 -0.1,1.32; 45 -0.1,2.72; 46 -1.5,2.72; 47 -2.9,2.72
SOT229P700X180-4N = smd 1.45 x 0.95: 1 -3.3,2.29; 2 -3.3,0; 3 -3.3,-2.29 | smd 1.45 x 3.25: 4 3.3,0
SOIC127P600X175-8N = smd 1.5 x 0.65: 1 -2.7,1.905; 2 -2.7,0.635; 3 -2.7,-0.635; 4 -2.7,-1.905; 5 2.7,-1.905; 6 2.7,-0.635; 7 2.7,0.635; 8 2.7,1.905
629105150521 = smd 0.45 x 1.3: 1 -1.3,2.9; 2 -0.65,2.9; 3 0,2.9; 4 0.65,2.9; 5 1.3,2.9 | drill 0.85 pad 1 long: S1 -3.725,2.9; S2 3.725,2.9 | drill 0.55 pad 0.9 long: S3 3.875,-0.9; S4 -3.875,-0.9 | hole 0.8: -2.5,1.85; 2.5,1.85
R0805 = smd 1.3 x 1.5: 1 -0.95,0; 2 0.95,0
MYLIB_SJ-SHORT = smd 1.168 x 1.6: 1 -0.762,0; 2 0.762,0
WE_436331045822 = smd 1.2 x 1: 1 2.8,0.85; 2 2.8,-0.85; 3 -2.8,0.85; 4 -2.8,-0.85 | hole 0.75: 0,1.375; 0,-1.375
452404020202 = drill 0.9: 1 2.5,1.65; 2 0,1.65; 3 -2.5,1.65; 4 2.5,-1.65; 5 0,-1.65; 6 -2.5,-1.65
SOT95P240X115-3N = smd 1.1 x 0.6: 1 -1.1,0.95; 2 -1.1,-0.95; 3 1.1,0
SOD323 = smd 1.075 x 0.5: 1 -1.162,0; 2 1.162,0
SOP65P640X120-14N = smd 1.475 x 0.45: 1 -2.938,1.95; 2 -2.938,1.3; 3 -2.938,0.65; 4 -2.938,0; 5 -2.938,-0.65; 6 -2.938,-1.3; 7 -2.938,-1.95; 8 2.938,-1.95; 9 2.938,-1.3; 10 2.938,-0.65; 11 2.938,0; 12 2.938,0.65; 13 2.938,1.3; 14 2.938,1.95
MA04-1 = drill 1.016 long: 1 -3.81,0; 2 -1.27,0; 3 1.27,0; 4 3.81,0

### Placement (x,y rotation side)
C1  26.67,31.45 270 top
C2  21.91,37.8 180 top
C3  26.35,8.91 270 top
C4  24.13,8.91 270 top
C5  31.12,20.66 270 bottom
C6  4.76,42.57 180 top
C7  4.76,44.79 0 top
C8  15.56,40.34 0 top
C9  15.56,42.57 0 top
C10  26.03,13.99 90 bottom
C16  24.77,17.48 0 bottom
C17  31.12,24.79 90 bottom
C18  45.72,-2.52 0 bottom
C19  46.99,20.98 0 bottom  (outside the outline)
C20  46.99,14.63 0 bottom  (outside the outline)
C23  48.89,5.1 180 bottom  (outside the outline)
C24  48.89,9.55 180 bottom  (outside the outline)
D1  9.84,38.44 180 top
D2  25.4,40.03 180 top
D3  15.88,37.49 0 top
D4  15.88,38.76 0 top
H1  18.73,39.07 180 top
IC1  12.07,18.44 180 top
IC2  20.95,33.04 180 top
IC4  26.67,23.52 180 top
J1  22.86,46.88 180 top
R1  21.91,40.03 0 top
R2  29.53,17.48 0 bottom
R3  23.49,13.99 90 bottom
R4  24.77,7.64 0 bottom
R5  4.76,36.53 180 top
R6  4.76,30.18 180 top
R7  11.43,44.79 0 top
R8  15.56,44.79 180 top
R9  11.43,42.57 180 top
R10  8.25,43.84 270 top
R11  18.41,28.91 270 bottom
R12  45.72,-6.96 0 bottom  (outside the outline)
R13  31.12,29.23 90 bottom
R14  24.77,10.82 180 bottom
S1  13.97,48.28 180 top
S2  6.35,48.28 180 top
S4  11.75,31.77 180 top
V1  4.76,33.36 90 top
V2  4.76,39.71 90 top
V3  26.67,36.85 270 top
V4  27.3,22.88 90 bottom
X1  29.21,10.82 90 top

### Tracks (layer width: path | path; a pad name or v marks a point on that pad's centre or on a via)
+3V3  (via drill 0.35)  (8 unrouted)
  Top 0.254: D1.6 D1.7 | C1.1
  Top 0.406: C9.1 C8.1 14.2,39.94 D1.7 12.19,40.47 v12.7,40.98 12.7,42.25 R9.1
  Top 0.813: v22.23,33.04 IC2.2 26.03,33.04 C1.1 | C3.1 C4.1 23.18,9.86 21.99,11.05 IC1.2
  Bottom 0.813: v12.7,40.98 12.7,37.49 13.97,36.22 19.05,36.22 v22.23,33.04
  pour Top (isolate 0.406): 18.73,10.5 19.69,10.5 20.32,11.13 20.32,30.5 22.86,33.04 22.54,33.36 21.59,33.36 18.73,30.5 18.73,26.37 17.14,24.79 17.14,22.25 17.78,21.61 17.78,11.45
+5V
  Top 0.813: V3.2 24.61,35.69 IC2.3 24.26,36.41 C2.1 R1.2
AGND  (via drill 0.35)  (8 unrouted)
  Top 0.254: X1.1 X1.2
  other vias: 28.58,29.87 28.58,30.82 28.58,31.77 28.58,32.72
  pour Bottom (isolate 0.406): 22.23,27.33 22.23,0.02 34.29,0.02 34.29,33.68 28.58,33.68 27.94,33.04 27.94,29.87 25.4,27.33
AINP  (3 unrouted)
  Bottom 0.254: V4.6 V4.7
DTR  (via drill 0.35)
  Top 0.254: V2.2 R5.1 5.71,36.22 v6.99,34.95 | D1.28 11.34,35.45 11.85,34.95 v12.07,34.95
  Bottom 0.254: v12.07,34.95 v6.99,34.95
EN  (via drill 0.35)  (2 unrouted)
  Top 0.254: S2.1 S2.2 | V1.3 4.62,34.31 4.62,33.51 v4.76,33.36 | v4.76,47.96 4.08,47.96 S2.1 | S2.1 3.81,47.17 C7.1 | IC1.3 20.18,12.32 19.37,13.13 v19.37,13.59 | v5.08,28.6 5.08,26.69 v8.89,22.88
  Bottom 0.254: v4.76,47.96 3.49,46.69 3.49,34.63 v4.76,33.36 5.08,33.04 v5.08,28.6 | v8.89,22.88 8.89,15.81 11.75,12.95 18.73,12.95 v19.37,13.59
GND  (via drill 0.35)  (1 unrouted)
  Top 0.254: D1.3 12.88,37.94 13.34,37.49 13.34,36.85 13.97,36.22
  Top 0.813: IC1.15 17.78,28.6 15.88,30.5 15.88,34.31 13.97,36.22 | 23.99,7.87 24.04,7.87 C4.2 C3.2
  Bottom 0.254: 18.41,18.44 v16.51,18.44
  Bottom 0.813: R11.2 20.95,25.61 20.95,20.98 18.41,18.44
  other vias: 14.61,20.02 13.34,20.02 12.07,20.02 10.79,18.44 10.79,17.17 10.79,15.9 12.38,14.31 13.65,14.31 14.92,14.31 16.51,17.17 16.51,15.9
  pour Bottom (isolate 0.406): 0,28.6 20.32,28.6 21.59,27.33 21.59,0.02 0,0.02
  pour Top (isolate 0.406, rank 3): 0,0.02 0,27.96 20.95,27.84 20.95,11.45 27.94,11.45 27.94,0.02
GPIO0  (via drill 0.35)
  Top 0.254: C6.1 v5.71,40.98 5.54,40.81 V2.3 4.62,40.66 3.81,40.66 1.91,38.76 1.91,27.38 3,26.29 IC1.25 | S1.4 S1.3 16.09,47.43 v15.56,47.96
  Bottom 0.254: v15.56,47.96 12.7,47.96 v5.71,40.98
N$1
  Top 0.254: H1.A 20.86,40.12 R1.1
N$2
  Top 0.178: 11.43,43.84 11.43,41.61
  Top 0.254: R8.2 R7.2 11.43,43.84 | 11.43,41.61 11.34,41.53 D1.8
N$3
  Top 0.254: R10.2 8.29,42.89 9.84,41.33 D1.11
N$4
  Top 0.254: D1.9 10.84,42.2 R9.2
N$6  (1 unrouted)
  Bottom 0.254: V4.1 V4.2
N$7
  Bottom 0.254: R3.2 25.72,17.16 C16.1 26.35,18.12 26.99,18.12 27.95,19.09 V4.3
N$8
  Bottom 0.254: R3.1 C10.1
N$9  (1 unrouted)
  Bottom 0.254: C17.2 R13.1
N$12  (2 unrouted)
N$15
  Top 0.254: V1.1 R5.2
N$16
  Top 0.254: R6.2 2.54,31.46 2.54,37.34 V2.1
N$17
  Bottom 0.254: C10.2 26.35,14.63 X1.4 X1.3 27.62,12.09 26.35,10.82 R14.2 R4.1
PGND  (via drill 0.35)  (5 unrouted)
  Bottom 0.813: v22.23,29.87 18.61,29.87 R11.1 18.41,31.14 21.91,31.14 v22.23,30.82
  other vias: 9.84,38.44 10.79,39.39 10.79,38.44 10.79,37.49 9.84,39.39 8.89,39.39 8.89,38.44 9.84,37.49 8.89,37.49 23.18,28.91 22.23,28.91 24.13,28.91
  pour Top (rank 4): 0,49.55 0,27.96 30.48,27.96 30.48,49.55
  pour Bottom (isolate 0.406, rank 4): 0,27.96 30.48,27.96 30.48,50.19 0,50.19
RTS
  Top 0.254: 5.71,29.87 R6.1 | 5.71,29.86 R6.1 | R6.1 V1.2 8.25,34.8 8.74,34.8 9.34,35.4 D1.24
RXD
  Top 0.254: D1.25 9.84,34.95 10.48,34.31 10.48,31.39 S4.2
RXD0  (via drill 0.35)
  Top 0.254: v5.08,15.26 4.67,14.86 IC1.34
  Bottom 0.254: S4.4 6.99,31.16 6.99,17.17 v5.08,15.26
RXD1  (via drill 0.35)
  Top 0.254: IC1.12 19.45,23.75 v19.05,24.15
  Bottom 0.254: S4.6 15.88,31.79 15.88,27.33 v19.05,24.15
TXD
  Top 0.254: D1.26 10.34,35.46 11.75,34.06 S4.5
TXD0  (via drill 0.35)
  Top 0.254: IC1.35 4.67,13.59 v5.08,13.99
  Bottom 0.254: v5.08,13.99 7.98,16.89 7.98,28.85 S4.1
TXD1  (via drill 0.35)
  Top 0.254: v19.05,22.88 19.45,22.48 IC1.11
  Bottom 0.254: v19.05,22.88 14.25,27.68 S4.3
USB_DN  (via drill 0.35)
  Top 0.254: J1.2 23.45,44.04 v23.45,45.74 | D1.5 13.79,38.94 v13.97,38.76 D4.1
  Bottom 0.254: v13.97,38.76 13.97,41.66 18.37,46.06 23.13,46.06 v23.45,45.74
USB_DP  (via drill 0.35)
  Top 0.254: J1.3 v22.86,42.57 | D1.4 13.34,38.44 v13.97,37.8 14.29,37.49 D3.1
  Bottom 0.254: v22.86,42.57 18.1,37.8 v13.97,37.8
VBUS
  Top 0.254: R8.1 16.82,44.79 18.09,46.06 21.91,46.06 22.54,46.69 23.81,46.69 24.16,46.35 J1.1 24.16,42.71
  Top 0.813: V3.1 26.17,38.51 D2.1 24.16,42.04 24.16,42.71
VSPI!CS  (1 unrouted)
VSPICLK  (1 unrouted)
VSPIQ_MISO  (1 unrouted)